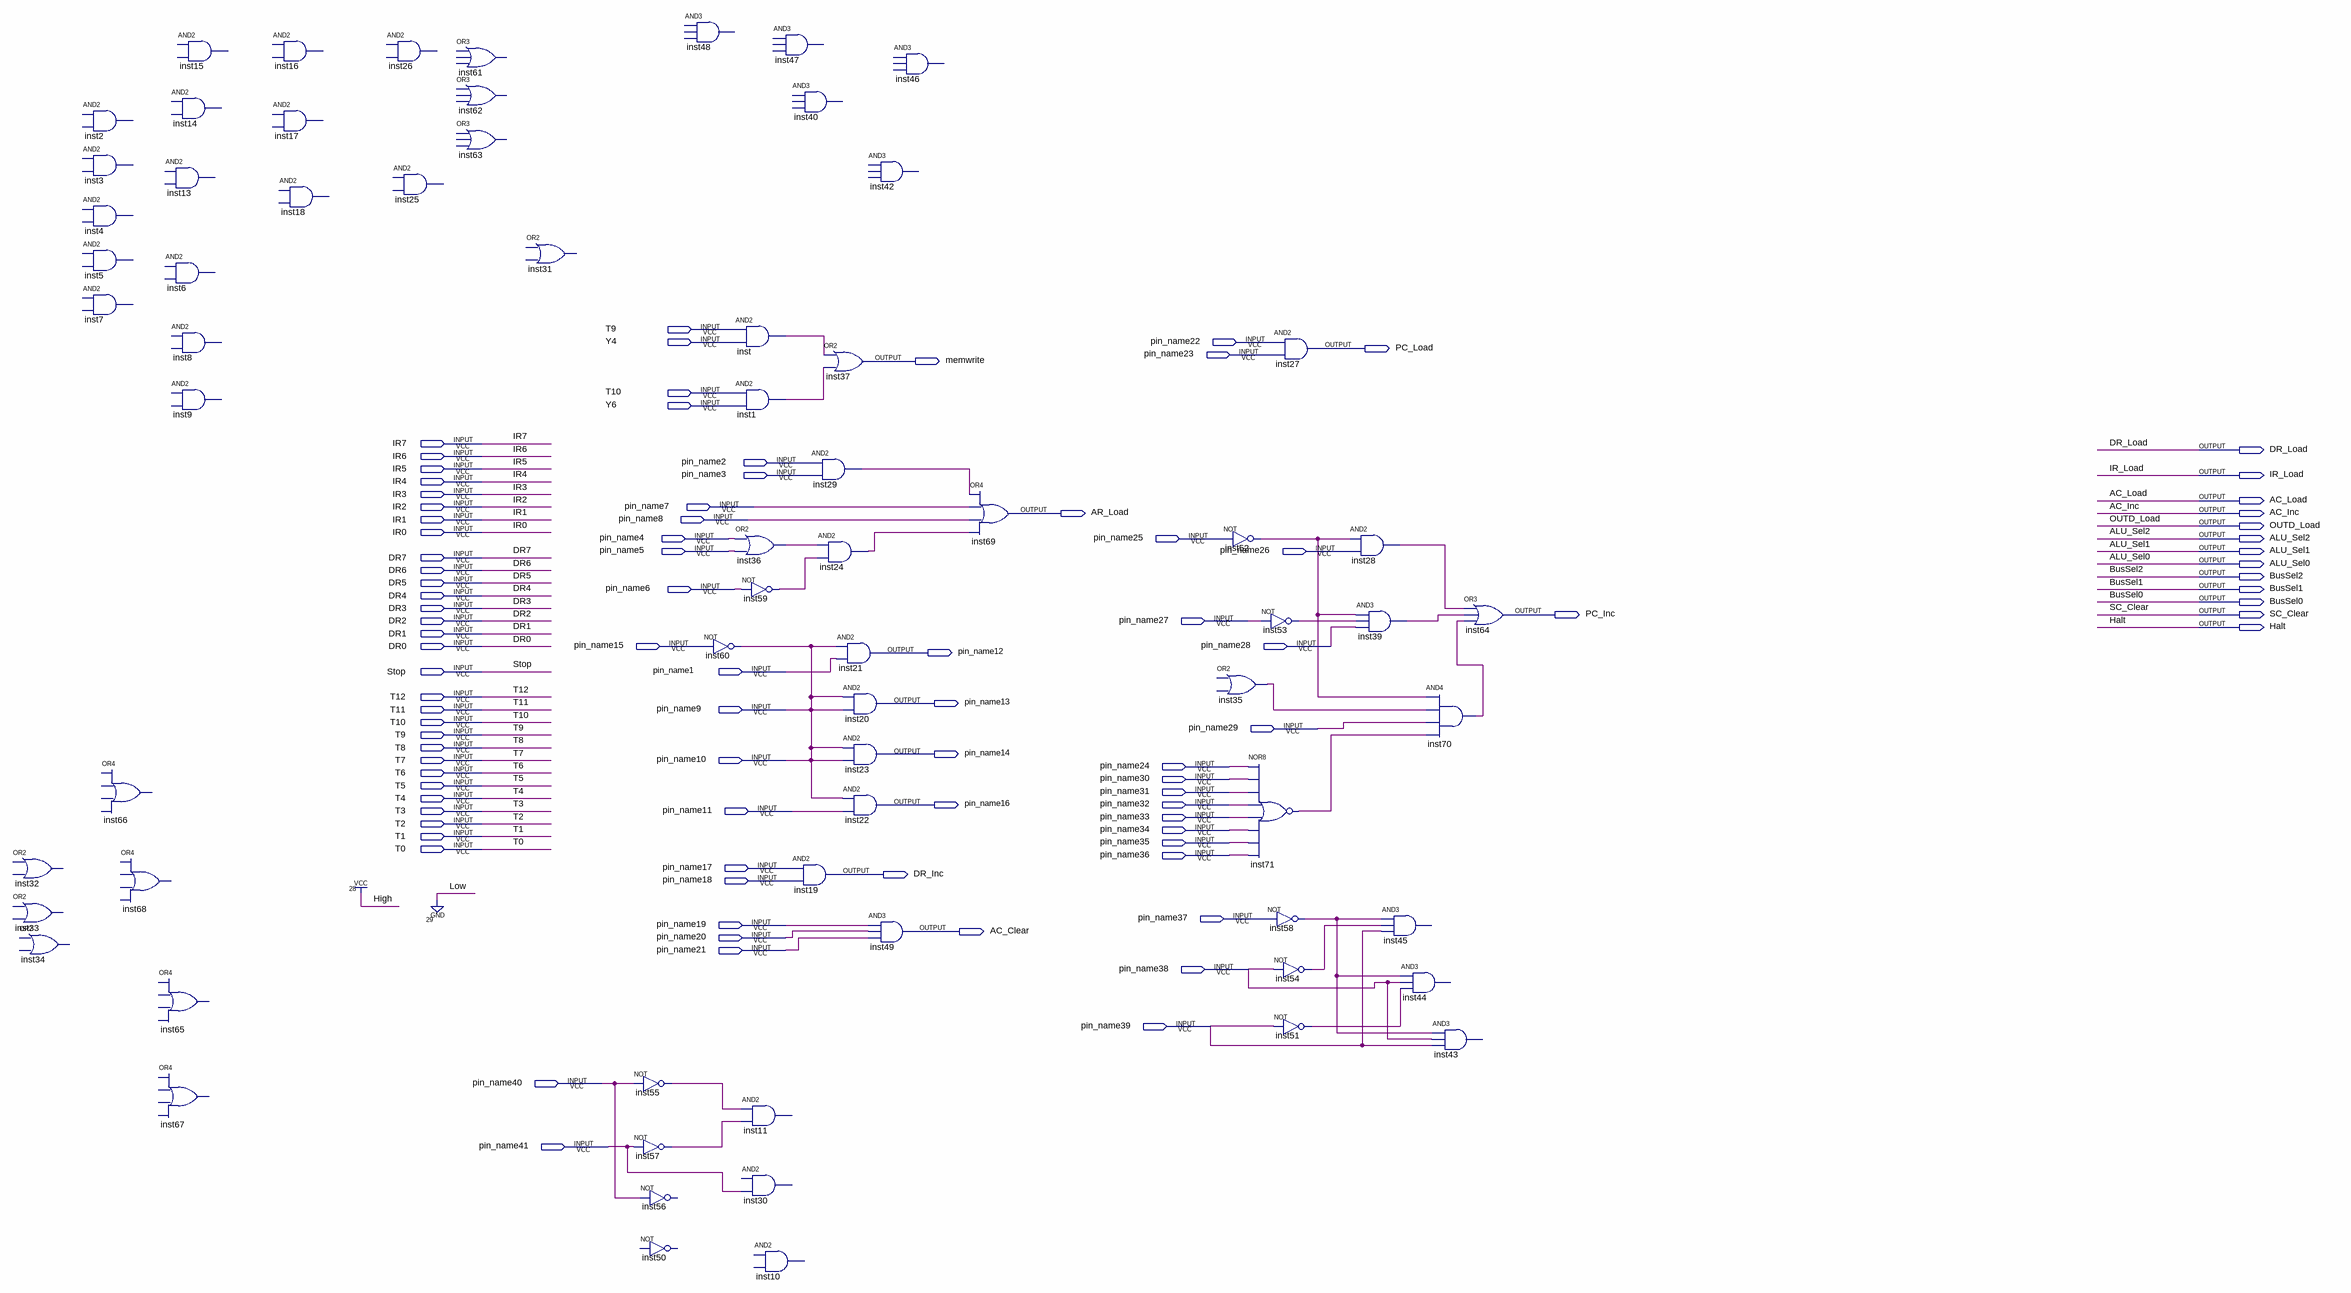
[diagram p0: schematic sheet]
// Quartus schematic lab3controller.bdf as structural Verilog: 69 symbols, 94 pins
module lab3controller (
  input  T9,
  input  Y4,
  input  pin_name22,
  input  pin_name23,
  input  T10,
  input  Y6,
  input  IR7,
  input  IR6,
  input  pin_name2,
  input  IR5,
  input  pin_name3,
  input  IR4,
  input  IR3,
  input  IR2,
  input  pin_name7,
  input  IR1,
  input  pin_name8,
  input  IR0,
  input  pin_name4,
  input  pin_name25,
  input  pin_name5,
  input  pin_name26,
  input  DR7,
  input  DR6,
  input  DR5,
  input  pin_name6,
  input  DR4,
  input  DR3,
  input  DR2,
  input  pin_name27,
  input  DR1,
  input  DR0,
  input  pin_name15,
  input  pin_name28,
  input  Stop,
  input  pin_name1,
  input  T12,
  input  T11,
  input  pin_name9,
  input  pin_name29,
  input  T8,
  input  T7,
  input  pin_name10,
  input  pin_name24,
  input  T6,
  input  pin_name30,
  input  T5,
  input  pin_name31,
  input  T4,
  input  pin_name32,
  input  T3,
  input  pin_name11,
  input  pin_name33,
  input  T2,
  input  pin_name34,
  input  T1,
  input  pin_name35,
  input  T0,
  input  pin_name36,
  input  pin_name17,
  input  pin_name18,
  input  pin_name37,
  input  pin_name19,
  input  pin_name20,
  input  pin_name21,
  input  pin_name38,
  input  pin_name39,
  input  pin_name40,
  input  pin_name41,
  output PC_Load,
  output memwrite,
  output DR_Load,
  output IR_Load,
  output AC_Load,
  output AR_Load,
  output AC_Inc,
  output OUTD_Load,
  output ALU_Sel2,
  output ALU_Sel1,
  output ALU_Sel0,
  output BusSel2,
  output BusSel1,
  output BusSel0,
  output PC_Inc,
  output SC_Clear,
  output Halt,
  output pin_name12,
  output pin_name13,
  output pin_name14,
  output pin_name16,
  output DR_Inc,
  output AC_Clear
);

  wire inst1_out, inst24_out, inst28_out, inst29_out, inst35_out, inst36_out, inst39_out, inst51_out,
       inst52_out, inst53_out, inst54_out, inst55_out, inst57_out, inst58_out, inst59_out, inst70_out,
       inst71_out, inst_out;

  // OR2 inst32 is placed but not wired
  // OR2 inst33 is placed but not wired
  // OR2 inst34 is placed but not wired
  // AND2 inst2 is placed but not wired
  // AND2 inst3 is placed but not wired
  // AND2 inst4 is placed but not wired
  // AND2 inst5 is placed but not wired
  // AND2 inst7 is placed but not wired
  // OR4 inst66 is placed but not wired
  // OR4 inst68 is placed but not wired
  // AND2 inst15 is placed but not wired
  // AND2 inst14 is placed but not wired
  // AND2 inst13 is placed but not wired
  // AND2 inst6 is placed but not wired
  // AND2 inst8 is placed but not wired
  // AND2 inst9 is placed but not wired
  // OR4 inst65 is placed but not wired
  // OR4 inst67 is placed but not wired
  // AND2 inst16 is placed but not wired
  // AND2 inst17 is placed but not wired
  // AND2 inst18 is placed but not wired
  // AND2 inst26 is placed but not wired
  // AND2 inst25 is placed but not wired
  // OR3 inst61 is placed but not wired
  // OR3 inst62 is placed but not wired
  // OR3 inst63 is placed but not wired
  // OR2 inst31 is placed but not wired
  not inst55 (inst55_out, pin_name40);
  not inst57 (inst57_out, pin_name41);
  // NOT inst56 has open pins: IN=pin_name40, OUT=open
  // NOT inst50 is placed but not wired
  // AND3 inst48 is placed but not wired
  and inst (inst_out, T9, Y4);
  and inst1 (inst1_out, T10, Y6);
  or inst36 (inst36_out, pin_name4, pin_name5);
  not inst59 (inst59_out, pin_name6);
  not inst60 (pin_name9, pin_name15);
  // AND2 inst11 has open pins: IN1=inst55_out, IN2=inst57_out, OUT=open
  // AND2 inst30 has open pins: IN1=open, IN2=pin_name41, OUT=open
  // AND3 inst47 is placed but not wired
  // AND3 inst40 is placed but not wired
  and inst19 (DR_Inc, pin_name17, pin_name18);
  // AND2 inst10 is placed but not wired
  or inst37 (memwrite, inst_out, inst1_out);
  and inst29 (inst29_out, pin_name2, pin_name3);
  and inst24 (inst24_out, inst36_out, inst59_out);
  and inst21 (pin_name12, pin_name9, pin_name1);
  and inst20 (pin_name13, pin_name9, pin_name9);
  and inst23 (pin_name14, pin_name9, pin_name9);
  and inst22 (pin_name16, pin_name9, pin_name11);
  // AND3 inst46 is placed but not wired
  // AND3 inst42 is placed but not wired
  and inst49 (AC_Clear, pin_name19, pin_name20, pin_name21);
  or inst69 (AR_Load, inst29_out, pin_name7, pin_name8, inst24_out);
  not inst52 (inst52_out, pin_name25);
  // OR2 inst35 has open pins: IN1=open, IN2=open, OUT=inst35_out
  nor inst71 (inst71_out, pin_name24, pin_name30, pin_name31, pin_name32, pin_name33, pin_name34, pin_name35, pin_name36);
  buf inst27 (PC_Load, pin_name23);  // AND2 open: IN1
  not inst53 (inst53_out, pin_name27);
  not inst58 (inst58_out, pin_name37);
  not inst54 (inst54_out, pin_name38);
  not inst51 (inst51_out, pin_name39);
  and inst28 (inst28_out, inst52_out, pin_name26);
  and inst39 (inst39_out, inst52_out, inst53_out, pin_name28);
  // AND3 inst45 has open pins: IN1=inst58_out, IN2=inst54_out, IN3=pin_name39, OUT=open
  // AND3 inst44 has open pins: IN1=inst58_out, IN2=pin_name38, IN3=inst51_out, OUT=open
  and inst70 (inst70_out, inst52_out, inst35_out, pin_name29, inst71_out);
  // AND3 inst43 has open pins: IN1=inst58_out, IN2=pin_name38, IN3=pin_name39, OUT=open
  or inst64 (PC_Inc, inst28_out, inst39_out, inst70_out);

  assign pin_name10 = pin_name9;
endmodule
